# Altium schematic sheet TF.SchDoc
size A4
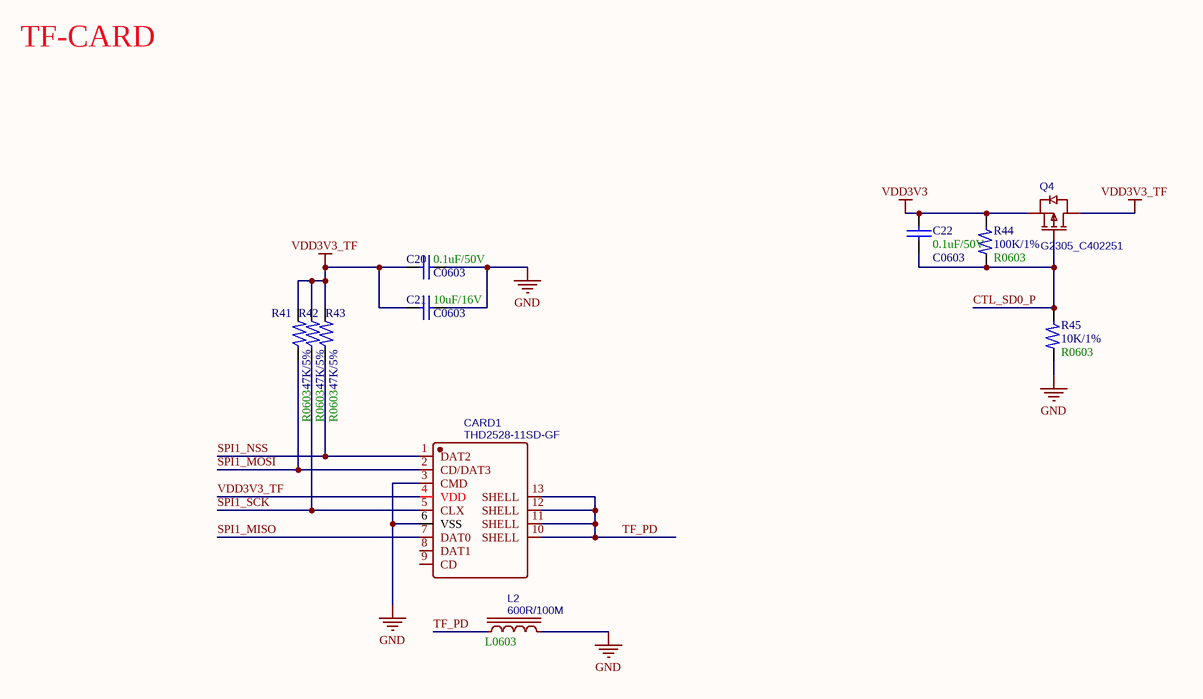
[diagram p0: TF.SchDoc]

## Parts
C20  0.1uF/50V  value C0603  [0603_C]
C21  10uF/16V  value C0603  [0603_C]
C22  0.1uF/50V  value C0603  [0603_C]
CARD1  THD2528-11SD-GF  [TF-SMD_THD2528-11SD-GF]
L2  600R/100M  [0603_L]
Q4  G2305_C402251  [SOT-23-3L]
R41  47K/5%  Footprint: R0603  [0603_R]
R42  47K/5%  Footprint: R0603  [0603_R]
R43  47K/5%  Footprint: R0603  [0603_R]
R44  100K/1%  Footprint: R0603  [0603_R]
R45  10K/1%  Footprint: R0603  [0603_R]

## Nets
GND: C20.2 C21.2 CARD1.3(CMD) CARD1.6(VSS) L2.2 R45.1
VDD3V3: C22.1 Q4.2(S) R44.2
VDD3V3_TF: C20.1 C21.1 CARD1.4(VDD) Q4.3(D) R41.1 R42.1 R43.1
CTL_SD0_P: C22.2 Q4.1(G) R44.1 R45.2
SPI1_MISO: CARD1.7(DAT0)
SPI1_MOSI: CARD1.2(CD/DAT3) R41.2
SPI1_NSS: CARD1.1(DAT2) R43.2
SPI1_SCK: CARD1.5(CLX) R42.2
TF_PD: CARD1.10(SHELL) CARD1.11(SHELL) CARD1.12(SHELL) CARD1.13(SHELL) L2.1

Not connected (* = marked no-connect by the designer): CARD1 8(DAT1) 9(CD)

## Notes on the sheet
- TF-CARD
- (in symbol SCBM160808U600T) L0603

## Library data of the parts
C20-C22 = CAP: Capacitor
CARD1 = THD2528-11SD-GF: BOM_Manufacturer: THD; Contributor: LCSC; BOM_Supplier: LCSC; BOM_Supplier Part: C283232; BOM_Manufacturer Part: THD2528-11SD-GF; BOM_JLCPCB Part Class: Extended Part; spicePre: C; spiceSymbolName: THD2528-11SD-GF
L2 = SCBM160808U600T: BOM_Manufacturer: Yanchuang; Contributor: LCSC; BOM_Supplier: LCSC; BOM_Supplier Part: C494701; BOM_Manufacturer Part: SCBM160808U600T; spicePre: L; spiceSymbolName: SCBM160808U600T
Q4 = G2305_C402251: BOM_Manufacturer: LGE; BOM_Manufacturer Part: G2305; Contributor: LCSC; BOM_Supplier: LCSC; BOM_Supplier Part: C402251; BOM_JLCPCB Part Class: Extended Part; spicePre: Q; spiceSymbolName: G2305_C402251
R41-R45 = 电阻